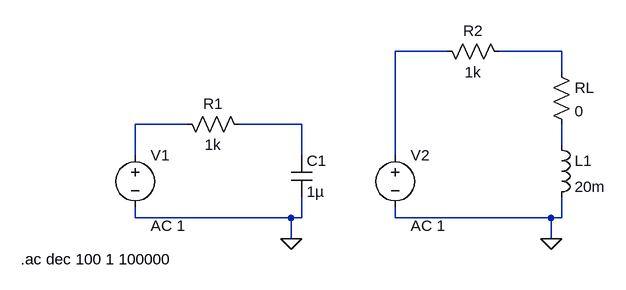
[diagram p0: schematic lpf_hpf_ltspice.asc]
lpf_hpf_ltspice.asc, the LTspice schematic file:
Version 4
SHEET 1 880 680
WIRE 480 0 400 0
WIRE 656 0 560 0
WIRE 656 32 656 0
WIRE 80 112 0 112
WIRE 256 112 160 112
WIRE 656 144 656 112
WIRE 0 160 0 112
WIRE 256 160 256 112
WIRE 400 160 400 0
WIRE 0 256 0 240
WIRE 240 256 0 256
WIRE 256 256 256 224
WIRE 256 256 240 256
WIRE 400 256 400 240
WIRE 640 256 400 256
WIRE 656 256 656 224
WIRE 656 256 640 256
WIRE 240 288 240 256
WIRE 640 288 640 256
FLAG 240 288 0
FLAG 640 288 0
SYMBOL res 64 96 M90
WINDOW 0 0 56 VBottom 2
WINDOW 3 32 56 VTop 2
SYMATTR InstName R1
SYMATTR Value 1k
SYMBOL cap 240 160 R0
SYMATTR InstName C1
SYMATTR Value 1µ
SYMBOL voltage 0 144 R0
WINDOW 123 24 124 Left 2
WINDOW 39 0 0 Left 0
SYMATTR Value2 AC 1
SYMATTR InstName V1
SYMATTR Value ""
SYMBOL res 464 -16 M90
WINDOW 0 0 56 VBottom 2
WINDOW 3 32 56 VTop 2
SYMATTR InstName R2
SYMATTR Value 1k
SYMBOL voltage 400 144 R0
WINDOW 123 24 124 Left 2
WINDOW 39 0 0 Left 0
SYMATTR Value2 AC 1
SYMATTR InstName V2
SYMATTR Value ""
SYMBOL ind 640 128 R0
SYMATTR InstName L1
SYMATTR Value 20m
SYMBOL res 640 16 R0
SYMATTR InstName RL
SYMATTR Value 0
TEXT -176 320 Left 2 !.ac dec 100 1 100000

The netlist it stands for:
* lpf_hpf_ltspice.asc
R1 N003 N004 1k
C1 N004 0 1µ
V1 N003 0 AC 1
R2 N001 N002 1k
V2 N001 0 AC 1
L1 N005 0 20m
RL N002 N005 0
.ac dec 100 1 100000
.backanno
.end